# Altium schematic sheet MainBoard_HMI.SchDoc: Main Board HMI
size A4; DrawnBy: M. Schwegler; Organization: HSLU T&A; Address1: Abteilung Elektrotechnik; Address2: Technikumsstrasse 21; Address3: CH-6048 Horw; Revision: v1; SheetNumber: 3; SheetTotal: 5; Projektname: SmartBoard; DocumentName: MainBoard; ProjectName: SmartBoard
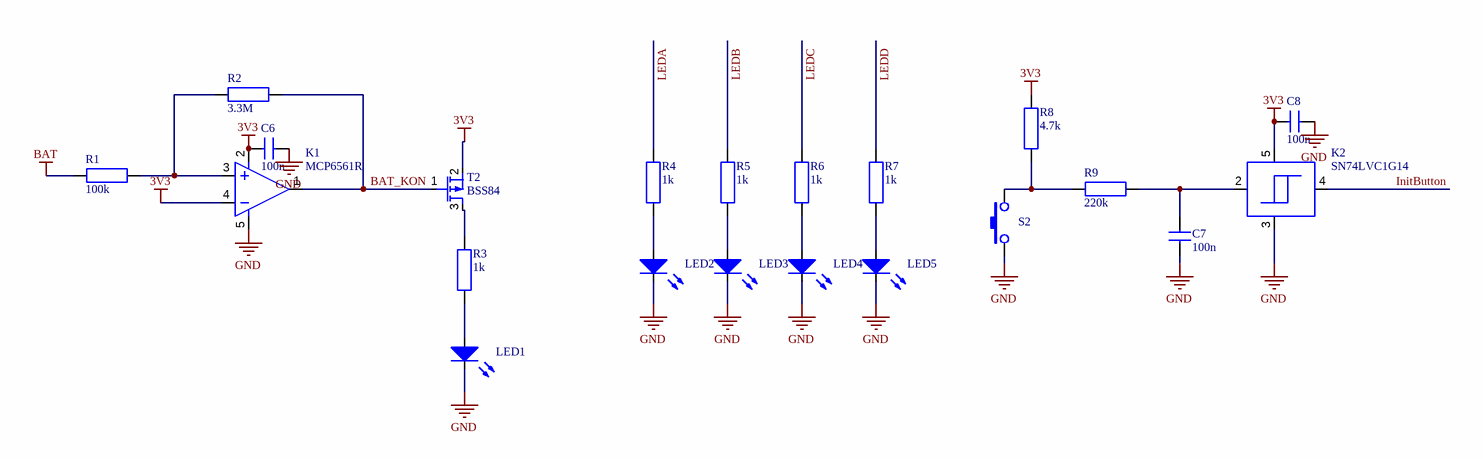
[diagram p0: MainBoard_HMI.SchDoc]

## Parts
C6  100n  [0805_C]
C7  100n  [0805_C]
C8  100n  [0805_C]
K1  MCP6561R  [SOT23-5]
K2  SN74LVC1G14  [SOT23-5]
LED1  (no value)  [LED_THT_3mm_RM_2.54mm]
LED2  (no value)  [LED_THT_3mm_RM_2.54mm]
LED3  (no value)  [LED_THT_3mm_RM_2.54mm]
LED4  (no value)  [LED_THT_3mm_RM_2.54mm]
LED5  (no value)  [LED_THT_3mm_RM_2.54mm]
R1  100k  [0805_R]
R2  3.3M  [0805_R]
R3  1k  [0805_R]
R4  1k  [0805_R]
R5  1k  [0805_R]
R6  1k  [0805_R]
R7  1k  [0805_R]
R8  4.7k  [0805_R]
R9  220k  [0805_r]
S2  S2  [SIP2]  (value not drawn)
T2  BSS84  [SOT23-3]

## Nets
3V3: C6.1 C8.1 K1.2 K1.4 K2.5 R8.1 T2.2(S)
BAT: R1.2
GND: C6.2 C7.1 C8.2 K1.5 K2.3 LED1.2(K) LED2.2(K) LED3.2(K) LED4.2(K) LED5.2(K) S2.1
BAT_KON: K1.1 R2.1 T2.1(G)
InitButton: K2.4
LEDA: R4.1
LEDB: R5.1
LEDC: R6.1
LEDD: R7.1
NetC7_2: C7.2 K2.2 R9.2
NetK1_3: K1.3 R1.1 R2.2
NetLED1_1: LED1.1(A) R3.2
NetLED2_1: LED2.1(A) R4.2
NetLED3_1: LED3.1(A) R5.2
NetLED4_1: LED4.1(A) R6.2
NetLED5_1: LED5.1(A) R7.2
NetR3_1: R3.1 T2.3(D)
NetR8_2: R8.2 R9.1 S2.2

## Notes on the sheet
- Project:
- Drawn by:
- Size:
- Sheet
- A4
- Rev.:
- of
- Date:
- File:

## Library data of the parts
C6-C8 = C?: Normaler Kondensator
K1 = OPAMP
K2 = schmitt
LED1-LED5 = LED
R1-R9 = R?: Normaler Widerstand
S2 = SW-PB
T2 = MOSFET-P 1D,2G,3S